# Altium schematic sheet SCH003.SchDoc: Power Supply
size A4; Date: 07-02-2024; DrawnBy: Nikhil Premjani; SheetNumber: 3; SheetTotal: 6; ModelNumber: EM411-202401-RMC001; ModelName: Remote Manipulation Controller
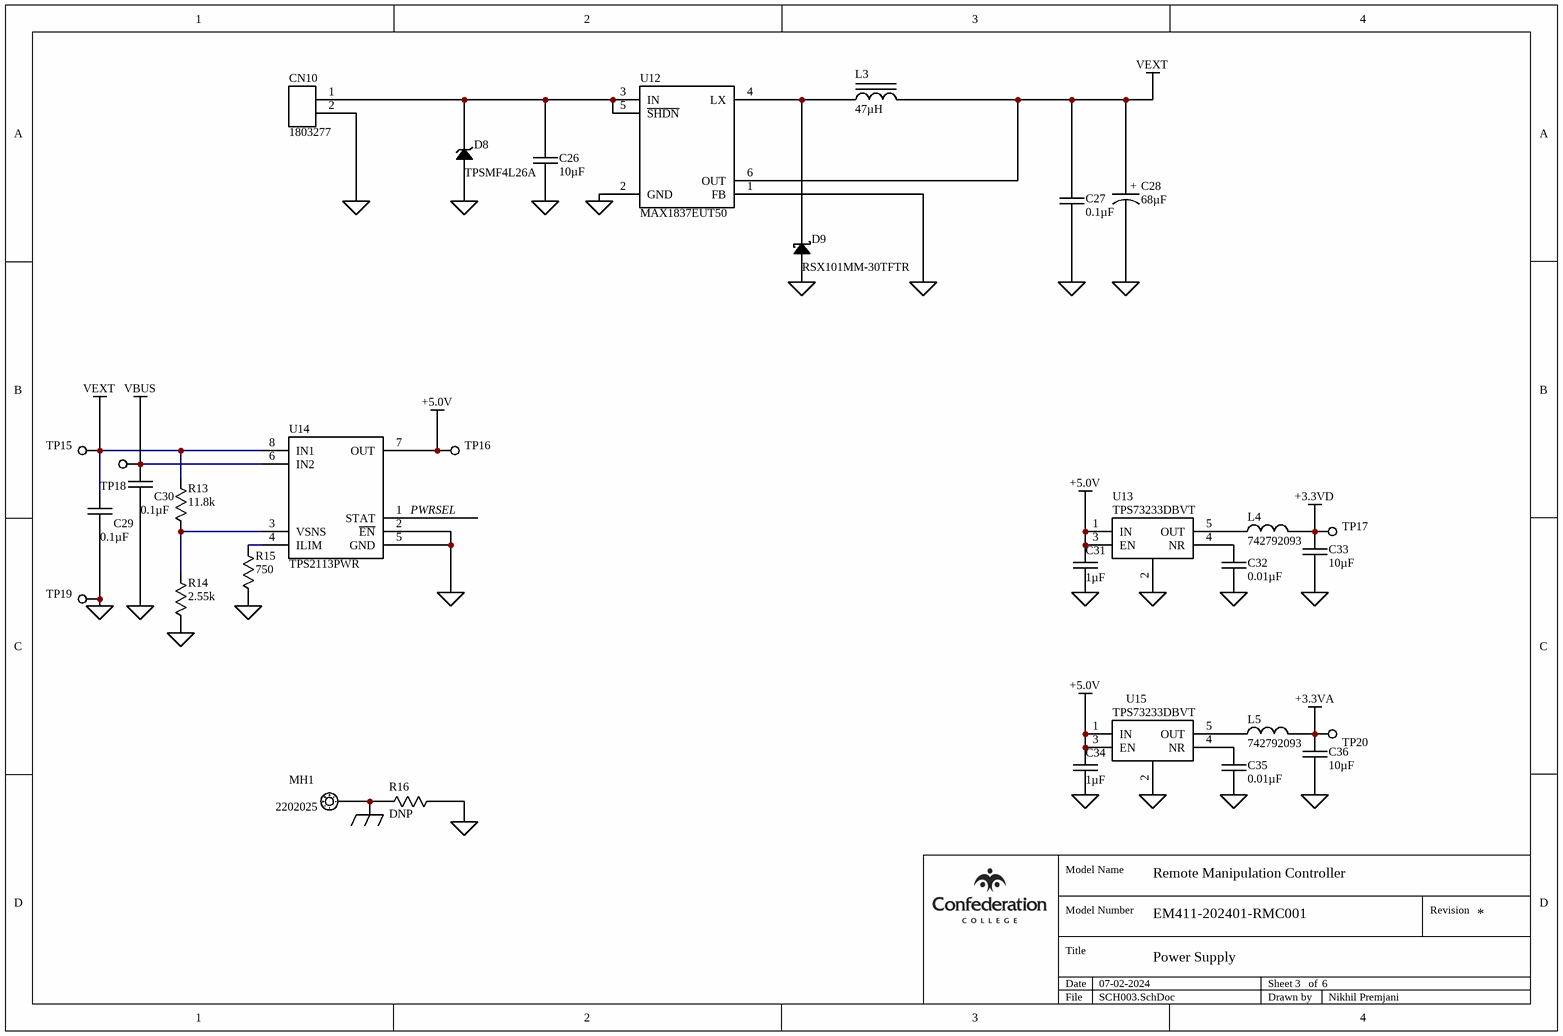
[diagram p0: SCH003.SchDoc]

## Parts
C26  10µF  [CAPC2012X14N]
C27  0.1µF  [CAPC2012X14N]
C28  68µF  [CAPAE7366X60M]
C29  0.1µF  [CAPC2012X14N]
C30  0.1µF  [CAPC2012X14N]
C31  1µF  [CAPC2012X14N]
C32  0.01µF  [CAPC2012X08N]
C33  10µF  [CAPC2012X14N]
C34  1µF  [CAPC2012X14N]
C35  0.01µF  [CAPC2012X08N]
C36  10µF  [CAPC2012X14N]
CN10  1803277  [PHOENIX_1803277]
D8  TPSMF4L26A  [SODFL370X108-2N]
D9  RSX101MM-30TFTR  [SODFL350X90-2N]
L3  47µH  [INDP102102X40N]
L4  742792093  [INDC2012X11N]
L5  742792093  [INDC2012X11N]
MH1  2202025  [PHOENIX_2202025]
R13  11.8k  [RESC2012X06N]
R14  2.55k  [RESC2012X06N]
R15  750  [RESC2012X06N]
R16  DNP  [RESC2012X06N]  (no BOM)
TP15  Test Point  [TP100]  (value not drawn)  (no BOM)
TP16  Test Point  [TP100]  (value not drawn)  (no BOM)
TP17  Test Point  [TP100]  (value not drawn)  (no BOM)
TP18  Test Point  [TP100]  (value not drawn)  (no BOM)
TP19  Test Point  [TP100]  (value not drawn)  (no BOM)
TP20  Test Point  [TP100]  (value not drawn)  (no BOM)
U12  MAX1837EUT50  [SOT95P280X145-6N]
U13  TPS73233DBVT  [SOT95P280X145-5N]
U14  TPS2113PWR  [TSOP65P640X120-8N]
U15  TPS73233DBVT  [SOT95P280X145-5N]

## Nets
+3.3VA: C36.1 L5.2 TP20.1
+3.3VD: C33.1 L4.2 TP17.1
+5.0V: C31.1 C34.1 TP16.1 U13.1(IN) U13.3(EN) U14.7(OUT) U15.1(IN) U15.3(EN)
CHGND: MH1.0 R16.1
GND: C26.2 C27.2 C28.2 C29.2 C30.2 C31.2 C32.2 C33.2 C34.2 C35.2 C36.2 CN10.2 D8.A D9.A R14.1 R15.1 R16.2 TP19.1 U12.1(FB) U12.2(GND) U13.2(GND) U14.2(~{EN}) U14.5(GND) U15.2(GND)
VBUS: C30.1 TP18.1 U14.6(IN2)
VEXT: C27.1 C28.1 C29.1 L3.1 R13.1 TP15.1 U12.6(OUT) U14.8(IN1)
PWRSEL: U14.1(STAT)
NetC26_1: C26.1 CN10.1 D8.K U12.3(IN) U12.5(~{SHDN})
NetC32_1: C32.1 U13.4(NR)
NetC35_1: C35.1 U15.4(NR)
NetD9_K: D9.K L3.2 U12.4(LX)
NetL4_1: L4.1 U13.5(OUT)
NetL5_1: L5.1 U15.5(OUT)
NetR13_2: R13.2 R14.2 U14.3(VSNS)
NetR15_2: R15.2 U14.4(ILIM)

## Notes on the sheet
- Model Number
- Model Name
- Revision
- Title
- Date
- Sheet
- of
- File
- Drawn by
- (in symbol APA0606680M010R) +

## Library data of the parts
C26 C33 C36 = CL21A106KAFN3NE: 10µF/25V 10% X5R Multi-Layer Ceramic Capacitor; Manufacturer: Samsung Electro-Mechanics; PartNumber: CL21A106KAFN3NE
C27 C29 C30 = UMK212B7104KGHT: 0.1µF/50V/±10% X7R Ceramic Chip Capacitor; Manufacturer: Taiyo Yuden; PartNumber: UMK212B7104KGHT
C28 = APA0606680M010R: 68µF/10V/20% SMD Aluminum Conductive Polymer Electrolytic Capacitor; Manufacturer: AVX; PartNumber: APA0606680M010R
C31 C34 = CL21B105KBFNNNG: 1µF/50V/±10% X7R Ceramic Chip Capacitor; Manufacturer: Samsung Electro-Mechanics; PartNumber: CL21B105KBFNNNG
C32 C35 = CL21B103KBANNNC: 0.01µF/50V/±10% X7R Ceramic Chip Capacitor; Manufacturer: Samsung Electro-Mechanics; PartNumber: CL21B103KBANNNC
CN10 = 1803277: MC 1,5/2G-3,81 Pluggable Terminal Block 2 Pos 3.81mm pitch Through Hole Header; Manufacturer: Phoenix Contact; PartNumber: 1803277
D8 = TPSMF4L26A: TVS Diode; Manufacturer: Littelfuse; PartNumber: TPSMF4L26A
D9 = RSX101MM-30TFTR: Schottky Barrier Diode; Manufacturer: Rohm Semiconductor; PartNumber: RSX101MM-30TFTR
L3 = MSS1038-473MLC: 47µH Shielded Power Inductor; Manufacturer: Coilcraft; PartNumber: MSS1038-473MLC
L4 L5 = 742792093: Multilayer SMD Ferrite; Manufacturer: Wurth Elektronik; PartNumber: 742792093
MH1 = 2202025: UM-BASIC/PRO PE CONTACT L1; Manufacturer: Phoenix Contact; PartNumber: 2202025
R13 = CR0805-FX-1182ELF: 11.8k, 1%, 0.125W Thick Film Chip Resistor; Manufacturer: Bourns; PartNumber: CR0805-FX-1182ELF
R14 = CR0805-FX-2551ELF: 2.55k, 1%, 0.125W Thick Film Chip Resistor; Manufacturer: Bourns; PartNumber: CR0805-FX-2551ELF
R15 = CR0805-FX-7500ELF: 750, 1%, 0.125W Thick Film Chip Resistor; Manufacturer: Bourns; PartNumber: CR0805-FX-7500ELF
R16 = DNP2012RES: Placeholder for 2012 Resistor; Manufacturer: Confederation College; PartNumber: DNP2012RES
TP15-TP20 = TP3: Test Point, Surface Mount, 3 mm; Manufacturer: Confederation College; PartNumber: N/A
U12 = MAX1837EUT50: 24V Internal Switch, 100% Duty Cycle, Step-Down Converter; Manufacturer: Maxim Integrated; PartNumber: MAX1837EUT50
U13 U15 = TPS73233DBVT: 250 mA, 3.3V Low Dropout Voltage Regulator; Manufacturer: Texas Instruments; PartNumber: TPS73233DBVT
U14 = TPS2113PWR: Autoswitching Power Mux; Manufacturer: Texas Instruments; PartNumber: TPS2113PWR